# Altium project 手电钻电机驱动板V.PrjPCB
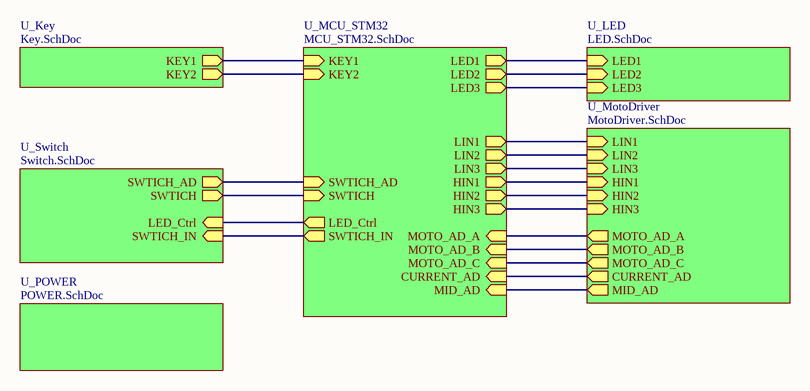
[diagram p0: 手电钻驱动板V.SchDoc]
7 sheets, 105 parts. Net scope: hierarchical (ports join the sheet entries above them; power ports are global).
Board file: 手电钻驱动板V0.1.PcbDoc
Sheets:
  手电钻驱动板V.SchDoc
    U_Key = Key.SchDoc
    U_LED = LED.SchDoc
    U_MCU_STM32 = MCU_STM32.SchDoc
    U_MotoDriver = MotoDriver.SchDoc
    U_Switch = Switch.SchDoc
    U_POWER = POWER.SchDoc

## Sheet 手电钻驱动板V.SchDoc
size A4

### Sub-sheets
U_Key = Key.SchDoc: KEY1 (out), KEY2 (out)
U_LED = LED.SchDoc: LED1 (in), LED2 (in), LED3 (in)
U_MCU_STM32 = MCU_STM32.SchDoc: MOTO_AD_A (in), MOTO_AD_B (in), MOTO_AD_C (in), LIN1 (out), LIN2 (out), LIN3 (out), HIN1 (out), HIN2 (out), HIN3 (out), MID_AD (in), CURRENT_AD (in), LED_Ctrl (out), SWTICH_AD (in), SWTICH_IN (out), SWTICH (in), LED1 (out), LED2 (out), LED3 (out), KEY1 (in), KEY2 (in)
U_MotoDriver = MotoDriver.SchDoc: LIN1 (in), LIN2 (in), LIN3 (in), HIN1 (in), HIN2 (in), HIN3 (in), MID_AD (out), CURRENT_AD (out), MOTO_AD_A (out), MOTO_AD_B (out), MOTO_AD_C (out)
U_POWER = POWER.SchDoc: no entries
U_Switch = Switch.SchDoc: LED_Ctrl (in), SWTICH_AD (out), SWTICH_IN (in), SWTICH (out)

### Nets
CURRENT_AD: sheet U_MCU_STM32/CURRENT_AD, sheet U_MotoDriver/CURRENT_AD
HIN1: sheet U_MCU_STM32/HIN1, sheet U_MotoDriver/HIN1
HIN2: sheet U_MCU_STM32/HIN2, sheet U_MotoDriver/HIN2
HIN3: sheet U_MCU_STM32/HIN3, sheet U_MotoDriver/HIN3
KEY1: sheet U_Key/KEY1, sheet U_MCU_STM32/KEY1
KEY2: sheet U_Key/KEY2, sheet U_MCU_STM32/KEY2
LED1: sheet U_LED/LED1, sheet U_MCU_STM32/LED1
LED2: sheet U_LED/LED2, sheet U_MCU_STM32/LED2
LED3: sheet U_LED/LED3, sheet U_MCU_STM32/LED3
LED_Ctrl: sheet U_MCU_STM32/LED_Ctrl, sheet U_Switch/LED_Ctrl
LIN1: sheet U_MCU_STM32/LIN1, sheet U_MotoDriver/LIN1
LIN2: sheet U_MCU_STM32/LIN2, sheet U_MotoDriver/LIN2
LIN3: sheet U_MCU_STM32/LIN3, sheet U_MotoDriver/LIN3
MID_AD: sheet U_MCU_STM32/MID_AD, sheet U_MotoDriver/MID_AD
MOTO_AD_A: sheet U_MCU_STM32/MOTO_AD_A, sheet U_MotoDriver/MOTO_AD_A
MOTO_AD_B: sheet U_MCU_STM32/MOTO_AD_B, sheet U_MotoDriver/MOTO_AD_B
MOTO_AD_C: sheet U_MCU_STM32/MOTO_AD_C, sheet U_MotoDriver/MOTO_AD_C
SWTICH: sheet U_MCU_STM32/SWTICH, sheet U_Switch/SWTICH
SWTICH_AD: sheet U_MCU_STM32/SWTICH_AD, sheet U_Switch/SWTICH_AD
SWTICH_IN: sheet U_MCU_STM32/SWTICH_IN, sheet U_Switch/SWTICH_IN

## Sheet Key.SchDoc
size A4
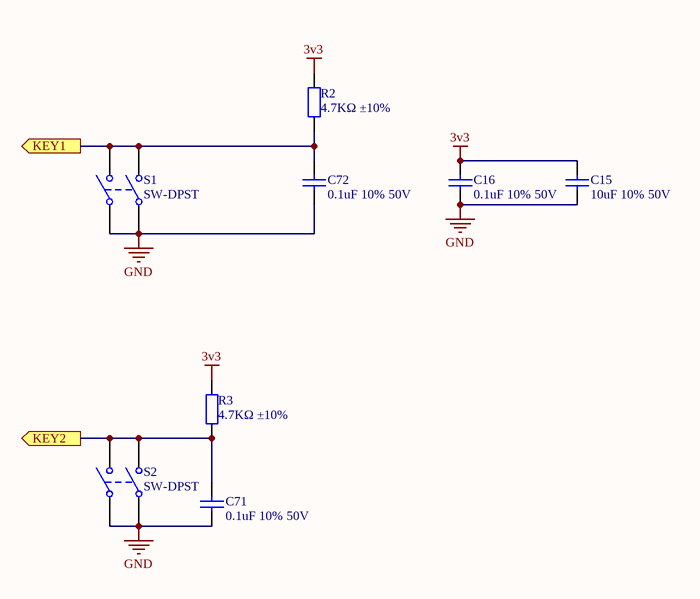
[diagram p1: Key.SchDoc]

### Parts
C15  10uF 10% 50V  [0805_C]
C16  0.1uF 10% 50V  [0603_C]
C71  0.1uF 10% 50V  [0603_C]
C72  0.1uF 10% 50V  [0603_C]
R2  4.7KΩ ±10%  [0603_R]
R3  4.7KΩ ±10%  [0603_R]
S1  SW-DPST  [SW1]
S2  SW-DPST  [SW1]

### Ports
KEY1 (out), KEY2 (out)

### Nets
3v3: C15.2 C16.2 R2.2 R3.2
GND: C15.1 C16.1 C71.1 C72.1 S1.1(COMMON1) S1.3(COMMON2) S2.1(COMMON1) S2.3(COMMON2)
KEY1: C72.2 R2.1 S1.2(NO1) S1.4(NO2) ; port KEY1
KEY2: C71.2 R3.1 S2.2(NO1) S2.4(NO2) ; port KEY2

### Library data of the parts
C15 C16 C71 C72 = 0603 4.7uF (475) 10% 16V: 贴片电容; ComponentLink1Description: 供应商链接; ComponentLink1URL: http://www.szlcsc.com/product/details_20375.html; Package: 0603; Supplier: LC; SuppliersPartNumber: C19666
R2 R3 = 0603 2.2Ω (2R20) 1%: 贴片电阻; ComponentLink1Description: 供应商链接; ComponentLink1URL: http://www.szlcsc.com/product/details_23666.html; Package: 0603; Supplier: LC; SuppliersPartNumber: C22939
S1 S2 = SW-DPST: Double-Pole, Single-Throw Switch; Published: 24-Mar-1999; LatestRevisionDate: 17-Jul-2002; LatestRevisionNote: Re-released for DXP Platform.; PackageReference: DPST-4; Publisher: Altium Limited; PackageDescription: Switch; 4 Leads

## Sheet LED.SchDoc
size A4
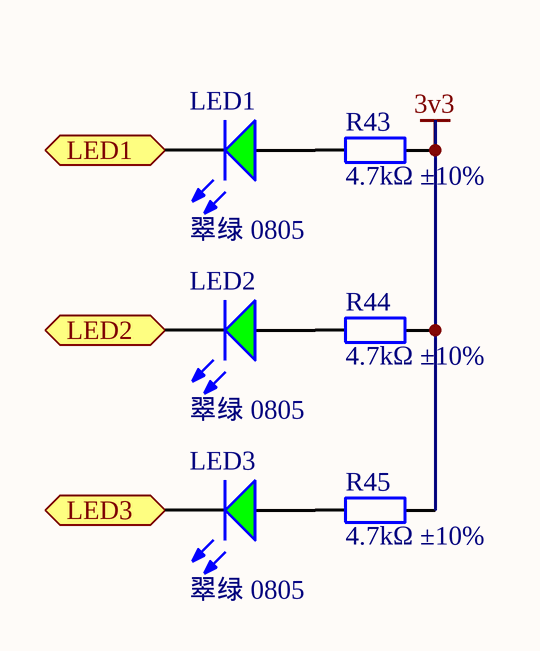
[diagram p2: LED.SchDoc]

### Parts
LED1  翠绿 0805  [0805_LED_S1]
LED2  翠绿 0805  [0805_LED_S1]
LED3  翠绿 0805  [0805_LED_S1]
R43  4.7kΩ ±10%  [0603_R]
R44  4.7kΩ ±10%  [0603_R]
R45  4.7kΩ ±10%  [0603_R]

### Ports
LED1 (in), LED2 (in), LED3 (in)

### Nets
3v3: R43.2 R44.2 R45.2
LED1: LED1.K ; port LED1
LED2: LED2.K ; port LED2
LED3: LED3.K ; port LED3
NetLED1_A: LED1.A R43.1
NetLED2_A: LED2.A R44.1
NetLED3_A: LED3.A R45.1

### Library data of the parts
LED1-LED3 = 0805 翠绿: 发光二极管; ComponentLink1Description: 供应商链接; ComponentLink1URL: http://www.szlcsc.com/product/details_2670.html; Package: 0805; Supplier: LC; SuppliersPartNumber: C2297
R43-R45 = 0603 2.2Ω (2R20) 1%: 贴片电阻; ComponentLink1Description: 供应商链接; ComponentLink1URL: http://www.szlcsc.com/product/details_23666.html; Package: 0603; Supplier: LC; SuppliersPartNumber: C22939

## Sheet MCU_STM32.SchDoc
size A4
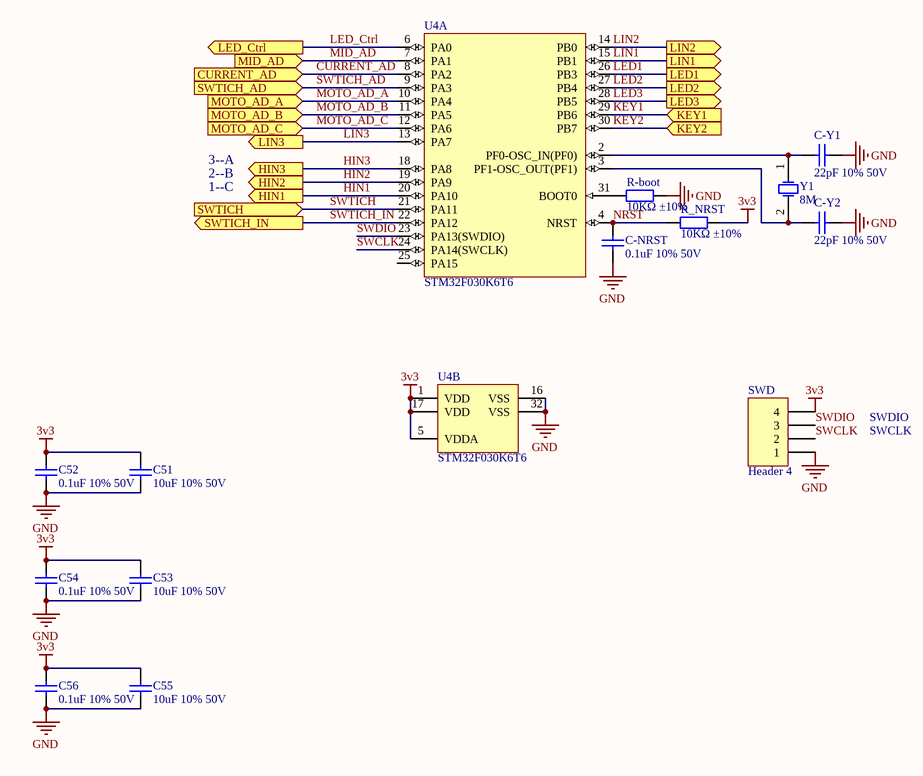
[diagram p3: MCU_STM32.SchDoc]

### Parts
C51  10uF 10% 50V  [0805_C]
C52  0.1uF 10% 50V  [0603_C]
C53  10uF 10% 50V  [0805_C]
C54  0.1uF 10% 50V  [0603_C]
C55  10uF 10% 50V  [0805_C]
C56  0.1uF 10% 50V  [0603_C]
C-NRST  0.1uF 10% 50V  [0603_C]
C-Y1  22pF 10% 50V  [0603_C]
C-Y2  22pF 10% 50V  [0603_C]
R-boot  10KΩ ±10%  [0603_R]
R_NRST  10KΩ ±10%  [0603_R]
SWD  Header 4  [FPC_1.25_4P]
U4  STM32F030K6T6  [STM-LQFP32_M]  (parts A,B of 2)
Y1  8M  [XTAL]

### Ports
CURRENT_AD (in), HIN1 (out), HIN2 (out), HIN3 (out), KEY1 (in), KEY2 (in), LED1 (out), LED2 (out), LED3 (out), LED_Ctrl (out), LIN1 (out), LIN2 (out), LIN3 (out), MID_AD (in), MOTO_AD_A (in), MOTO_AD_B (in), MOTO_AD_C (in), SWTICH (in), SWTICH_AD (in), SWTICH_IN (out)

### Nets
3v3: C51.2 C52.2 C53.2 C54.2 C55.2 C56.2 R_NRST.1 SWD.4 U4.1(VDD) U4.5(VDDA) U4.17(VDD)
GND: C51.1 C52.1 C53.1 C54.1 C55.1 C56.1 C-NRST.1 C-Y1.1 C-Y2.1 R-boot.1 SWD.1 U4.16(VSS) U4.32(VSS)
CURRENT_AD: U4.8(PA2) ; port CURRENT_AD
HIN1: U4.20(PA10) ; port HIN1
HIN2: U4.19(PA9) ; port HIN2
HIN3: U4.18(PA8) ; port HIN3
KEY1: U4.29(PB6) ; port KEY1
KEY2: U4.30(PB7) ; port KEY2
LED1: U4.26(PB3) ; port LED1
LED2: U4.27(PB4) ; port LED2
LED3: U4.28(PB5) ; port LED3
LED_Ctrl: U4.6(PA0) ; port LED_Ctrl
LIN1: U4.15(PB1) ; port LIN1
LIN2: U4.14(PB0) ; port LIN2
LIN3: U4.13(PA7) ; port LIN3
MID_AD: U4.7(PA1) ; port MID_AD
MOTO_AD_A: U4.10(PA4) ; port MOTO_AD_A
MOTO_AD_B: U4.11(PA5) ; port MOTO_AD_B
MOTO_AD_C: U4.12(PA6) ; port MOTO_AD_C
NRST: C-NRST.2 R_NRST.2 U4.4(NRST)
SWCLK: SWD.2 U4.24(PA14(SWCLK))
SWDIO: SWD.3 U4.23(PA13(SWDIO))
SWTICH: U4.21(PA11) ; port SWTICH
SWTICH_AD: U4.9(PA3) ; port SWTICH_AD
SWTICH_IN: U4.22(PA12) ; port SWTICH_IN
NetC-Y1_2: C-Y1.2 U4.2(PF0-OSC_IN(PF0)) Y1.1(OSC1)
NetC-Y2_2: C-Y2.2 U4.3(PF1-OSC_OUT(PF1)) Y1.2(OSC2)
NetR-boot_2: R-boot.2 U4.31(BOOT0)

Not connected (* = marked no-connect by the designer): U4 25(PA15)

### Notes on the sheet
- 3--A
- 2--B
- 1--C
- SWDIO
- SWCLK

### Library data of the parts
C51 C53 C55 = 0805 1uF (105) 10% 50V: 贴片电容; ComponentLink1Description: 供应商链接; ComponentLink1URL: http://www.szlcsc.com/product/details_29074.html; Package: 0805; Supplier: LC; SuppliersPartNumber: C28323
C52 C54 C56 C-NRST C-Y1 C-Y2 = 0603 4.7uF (475) 10% 16V: 贴片电容; ComponentLink1Description: 供应商链接; ComponentLink1URL: http://www.szlcsc.com/product/details_20375.html; Package: 0603; Supplier: LC; SuppliersPartNumber: C19666
R-boot R_NRST = 0603 2.2Ω (2R20) 1%: 贴片电阻; ComponentLink1Description: 供应商链接; ComponentLink1URL: http://www.szlcsc.com/product/details_23666.html; Package: 0603; Supplier: LC; SuppliersPartNumber: C22939
SWD = Header 4: Header, 4-Pin; LatestRevisionDate: 17-Jul-2002; LatestRevisionNote: Re-released for DXP Platform.; Publisher: Altium Limited
U4 = MC-ARM-STM32F030-SQ32
Y1 = XTAL: Crystal Oscillator; Published: 8-Jun-2000; LatestRevisionDate: 17-Jul-2002; LatestRevisionNote: Re-released for DXP Platform.; PackageReference: R38; Publisher: Altium Limited; PackageDescription: Crystal, Thru-Hole; 2 Leads; Body 3.1 x 8.2 mm (Dia.xH)

## Sheet MotoDriver.SchDoc
size A4
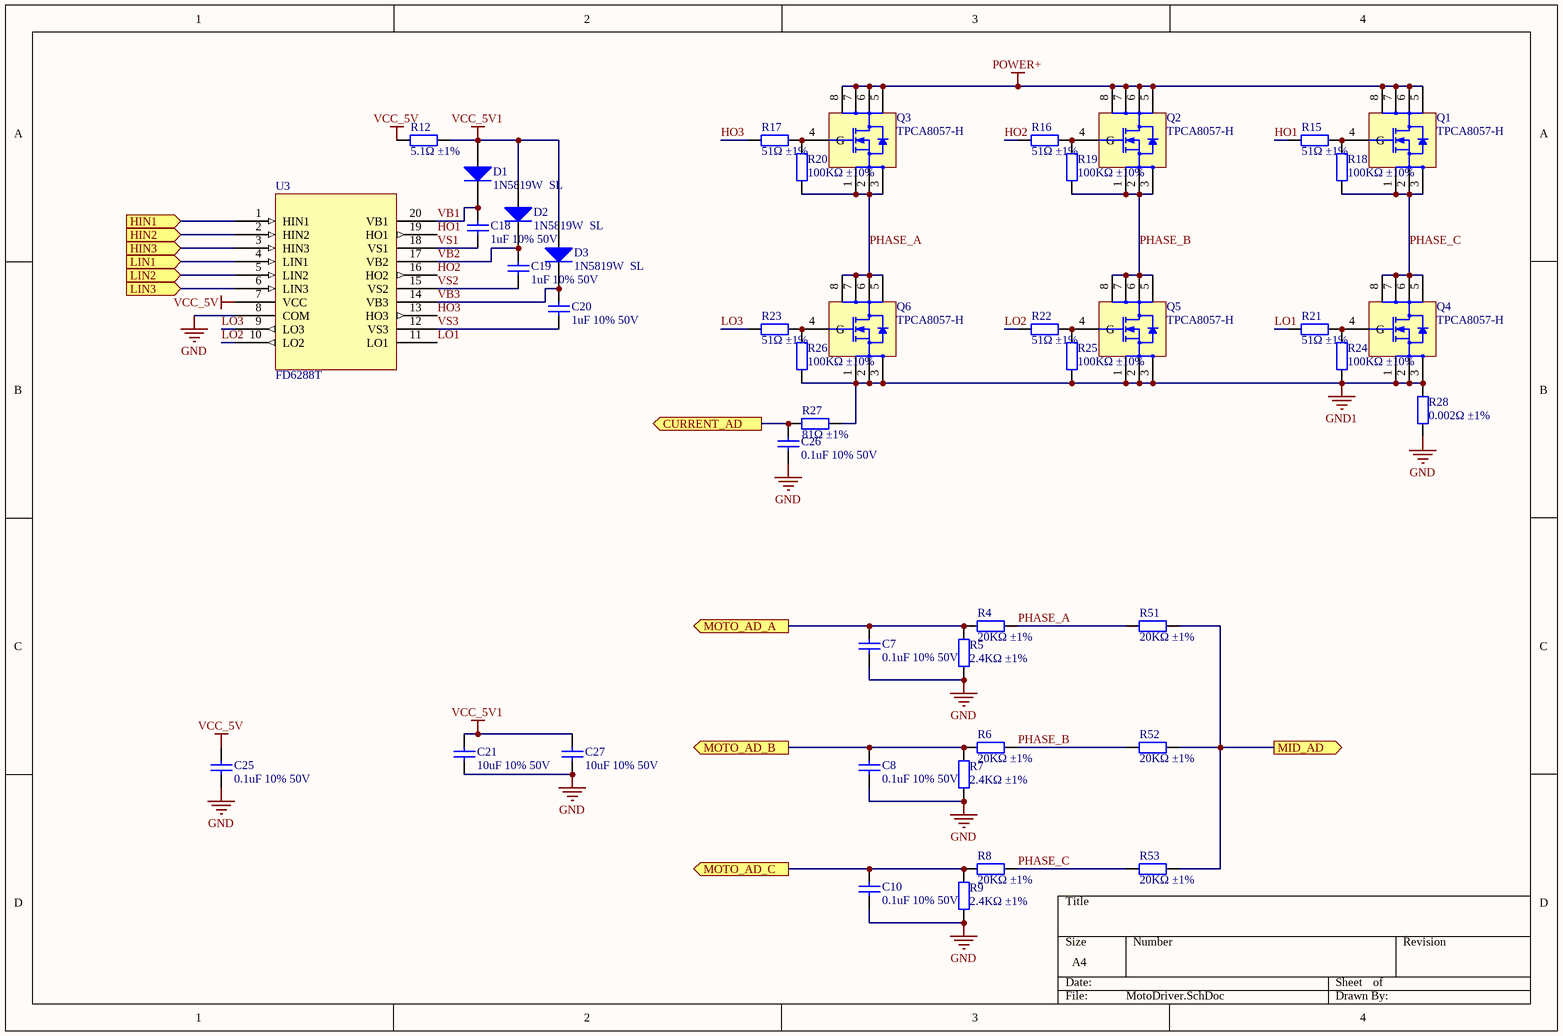
[diagram p4: MotoDriver.SchDoc]

### Parts
C7  0.1uF 10% 50V  [0603_C]
C8  0.1uF 10% 50V  [0603_C]
C10  0.1uF 10% 50V  [0603_C]
C18  1uF 10% 50V  [0805_C]
C19  1uF 10% 50V  [0805_C]
C20  1uF 10% 50V  [0805_C]
C21  10uF 10% 50V  [0805_C]
C25  0.1uF 10% 50V  [0603_C]
C26  0.1uF 10% 50V  [0603_C]
C27  10uF 10% 50V  [0805_C]
D1  1N5819W  SL  [SOD-123]
D2  1N5819W  SL  [SOD-123]
D3  1N5819W  SL  [SOD-123]
Q1  TPCA8057-H  [TPCA8057-H]
Q2  TPCA8057-H  [TPCA8057-H]
Q3  TPCA8057-H  [TPCA8057-H]
Q4  TPCA8057-H  [TPCA8057-H]
Q5  TPCA8057-H  [TPCA8057-H]
Q6  TPCA8057-H  [TPCA8057-H]
R4  20KΩ ±1%  [0603_R]
R5  2.4KΩ ±1%  [0603_R]
R6  20KΩ ±1%  [0603_R]
R7  2.4KΩ ±1%  [0603_R]
R8  20KΩ ±1%  [0603_R]
R9  2.4KΩ ±1%  [0603_R]
R12  5.1Ω ±1%  [1206_R]
R15  51Ω ±1%  [0603_R]
R16  51Ω ±1%  [0603_R]
R17  51Ω ±1%  [0603_R]
R18  100KΩ ±10%  [0603_R]
R19  100KΩ ±10%  [0603_R]
R20  100KΩ ±10%  [0603_R]
R21  51Ω ±1%  [0603_R]
R22  51Ω ±1%  [0603_R]
R23  51Ω ±1%  [0603_R]
R24  100KΩ ±10%  [0603_R]
R25  100KΩ ±10%  [0603_R]
R26  100KΩ ±10%  [0603_R]
R27  81Ω ±1%  [0603_R]
R28  0.002Ω ±1%  [RESC2512(6432)_M]
R51  20KΩ ±1%  [0603_R]
R52  20KΩ ±1%  [0603_R]
R53  20KΩ ±1%  [0603_R]
U3  FD6288T  [TSSOP20_M]

### Ports
CURRENT_AD (out), HIN1 (in), HIN2 (in), HIN3 (in), LIN1 (in), LIN2 (in), LIN3 (in), MID_AD (out), MOTO_AD_A (out), MOTO_AD_B (out), MOTO_AD_C (out)

### Nets
GND: C7.1 C8.1 C10.1 C21.1 C25.1 C26.1 C27.1 R5.1 R7.1 R9.1 R28.1 U3.8(COM)
GND1: Q4.1(S) Q4.2(S) Q4.3(S) Q5.1(S) Q5.2(S) Q5.3(S) Q6.1(S) Q6.2(S) Q6.3(S) R24.1 R25.1 R26.1 R27.2 R28.2
POWER+: Q1.5(D) Q1.6(D) Q1.7(D) Q1.8(D) Q2.5(D) Q2.6(D) Q2.7(D) Q2.8(D) Q3.5(D) Q3.6(D) Q3.7(D) Q3.8(D)
VCC_5V: C25.2 R12.1 U3.7(VCC)
VCC_5V1: C21.2 C27.2 D1.1(A) D2.1(A) D3.1(A) R12.2
CURRENT_AD: C26.2 R27.1 ; port CURRENT_AD
HIN1: U3.1(HIN1) ; port HIN1
HIN2: U3.2(HIN2) ; port HIN2
HIN3: U3.3(HIN3) ; port HIN3
HO1: R15.1 U3.19(HO1)
HO2: R16.1 U3.16(HO2)
HO3: R17.1 U3.13(HO3)
LIN1: U3.4(LIN1) ; port LIN1
LIN2: U3.5(LIN2) ; port LIN2
LIN3: U3.6(LIN3) ; port LIN3
LO1: R21.1 U3.11(LO1)
LO2: R22.1 U3.10(LO2)
LO3: R23.1 U3.9(LO3)
MID_AD: R51.2 R52.2 R53.2 ; port MID_AD
MOTO_AD_A: C7.2 R4.1 R5.2 ; port MOTO_AD_A
MOTO_AD_B: C8.2 R6.1 R7.2 ; port MOTO_AD_B
MOTO_AD_C: C10.2 R8.1 R9.2 ; port MOTO_AD_C
PHASE_A: Q3.1(S) Q3.2(S) Q3.3(S) Q6.5(D) Q6.6(D) Q6.7(D) Q6.8(D) R4.2 R20.1 R51.1
PHASE_B: Q2.1(S) Q2.2(S) Q2.3(S) Q5.5(D) Q5.6(D) Q5.7(D) Q5.8(D) R6.2 R19.1 R52.1
PHASE_C: Q1.1(S) Q1.2(S) Q1.3(S) Q4.5(D) Q4.6(D) Q4.7(D) Q4.8(D) R8.2 R18.1 R53.1
VB1: C18.2 D1.2(K) U3.20(VB1)
VB2: C19.2 D2.2(K) U3.17(VB2)
VB3: C20.2 D3.2(K) U3.14(VB3)
VS1: C18.1 U3.18(VS1)
VS2: C19.1 U3.15(VS2)
VS3: C20.1 U3.12(VS3)
NetQ1_4: Q1.4(G) R15.2 R18.2
NetQ2_4: Q2.4(G) R16.2 R19.2
NetQ3_4: Q3.4(G) R17.2 R20.2
NetQ4_4: Q4.4(G) R21.2 R24.2
NetQ5_4: Q5.4(G) R22.2 R25.2
NetQ6_4: Q6.4(G) R23.2 R26.2

### Library data of the parts
C7 C8 C10 C25-C27 = 0603 4.7uF (475) 10% 16V: 贴片电容; ComponentLink1Description: 供应商链接; ComponentLink1URL: http://www.szlcsc.com/product/details_20375.html; Package: 0603; Supplier: LC; SuppliersPartNumber: C19666
C18-C21 = 0805 1uF (105) 10% 50V: 贴片电容; ComponentLink1Description: 供应商链接; ComponentLink1URL: http://www.szlcsc.com/product/details_29074.html; Package: 0805; Supplier: LC; SuppliersPartNumber: C28323
D1-D3 = SOD-123 B5819W  SL: 肖特基二极管; ComponentLink1Description: 供应商链接; ComponentLink1URL: http://www.szlcsc.com/product/details_9093.html; Package: SOD-123; Supplier: LC; SuppliersPartNumber: C8598
Q1-Q6 = TPCA8057-H: MOSFETsSilicon N-Channel MOS (U-MOS-H)
R4-R9 R15-R28 R51-R53 = 0603 2.2Ω (2R20) 1%: 贴片电阻; ComponentLink1Description: 供应商链接; ComponentLink1URL: http://www.szlcsc.com/product/details_23666.html; Package: 0603; Supplier: LC; SuppliersPartNumber: C22939
R12 = 0402 51Ω (51R0) 1%: 贴片电阻; ComponentLink1Description: 供应商链接; ComponentLink1URL: http://www.szlcsc.com/product/details_25868.html; Package: 0402; Supplier: LC; SuppliersPartNumber: C25125
U3 = FD6288T: USB to TTL Serial / UART

## Sheet Switch.SchDoc
size A4
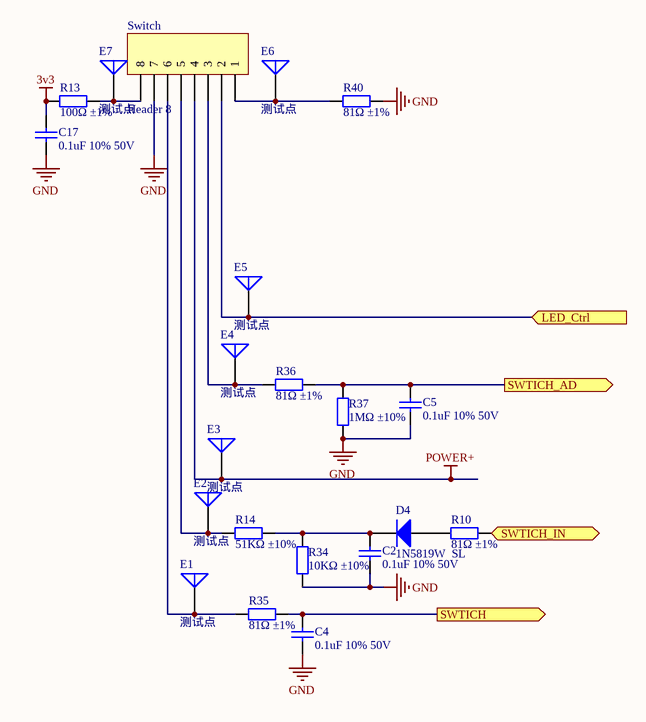
[diagram p5: Switch.SchDoc]

### Parts
C2  0.1uF 10% 50V  [0603_C]
C4  0.1uF 10% 50V  [0603_C]
C5  0.1uF 10% 50V  [0603_C]
C17  0.1uF 10% 50V  [0603_C]
D4  1N5819W  SL  [SOD-123]
E1  测试点  [Test]
E2  测试点  [Test]
E3  测试点  [Test]
E4  测试点  [Test]
E5  测试点  [Test]
E6  测试点  [Test]
E7  测试点  [Test]
R10  81Ω ±1%  [0603_R]
R13  100Ω ±1%  [0603_R]
R14  51KΩ ±10%  [0603_R]
R34  10KΩ ±10%  [0603_R]
R35  81Ω ±1%  [0603_R]
R36  81Ω ±1%  [0603_R]
R37  1MΩ ±10%  [0603_R]
R40  81Ω ±1%  [0603_R]
Switch  Header 8  [SH1.0mm-8P]

### Ports
LED_Ctrl (in), SWTICH (out), SWTICH_AD (out), SWTICH_IN (in)

### Nets
3v3: C17.2 R13.1
GND: C2.1 C4.1 C5.1 C17.1 R34.1 R37.1 R40.2 Switch.7
POWER+: E3.1(A) Switch.4
LED_Ctrl: E5.1(A) Switch.2 ; port LED_Ctrl
SWTICH: C4.2 R35.2 ; port SWTICH
SWTICH_AD: C5.2 R36.2 R37.2 ; port SWTICH_AD
SWTICH_IN: R10.2 ; port SWTICH_IN
NetC2_2: C2.2 D4.2(K) R14.2 R34.2
NetD4_1: D4.1(A) R10.1
NetE1_1: E1.1(A) R35.1 Switch.6
NetE2_1: E2.1(A) R14.1 Switch.5
NetE4_1: E4.1(A) R36.1 Switch.3
NetE6_1: E6.1(A) R40.1 Switch.1
NetE7_1: E7.1(A) R13.2 Switch.8

### Library data of the parts
C2 C4 C5 C17 = 0603 4.7uF (475) 10% 16V: 贴片电容; ComponentLink1Description: 供应商链接; ComponentLink1URL: http://www.szlcsc.com/product/details_20375.html; Package: 0603; Supplier: LC; SuppliersPartNumber: C19666
D4 = SOD-123 B5819W  SL: 肖特基二极管; ComponentLink1Description: 供应商链接; ComponentLink1URL: http://www.szlcsc.com/product/details_9093.html; Package: SOD-123; Supplier: LC; SuppliersPartNumber: C8598
E1-E7 = Antenna: Generic Antenna; Published: 24-Mar-1999; LatestRevisionDate: 17-Jul-2002; LatestRevisionNote: Re-released for DXP Platform.; PackageReference: PIN1; Publisher: Altium Limited
R10 R13 R14 R34-R37 R40 = 0603 2.2Ω (2R20) 1%: 贴片电阻; ComponentLink1Description: 供应商链接; ComponentLink1URL: http://www.szlcsc.com/product/details_23666.html; Package: 0603; Supplier: LC; SuppliersPartNumber: C22939
Switch = Header 8: Header, 8-Pin; LatestRevisionDate: 17-Jul-2002; LatestRevisionNote: Re-released for DXP Platform.; Publisher: Altium Limited

## Sheet POWER.SchDoc
size A4
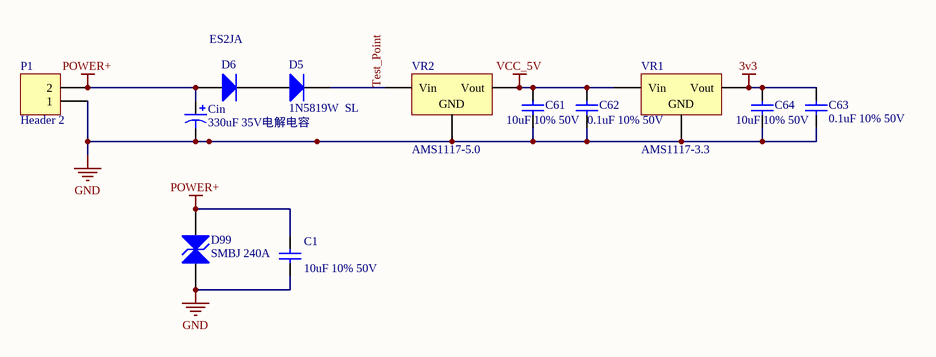
[diagram p6: POWER.SchDoc]

### Parts
C1  10uF 10% 50V  [0805_C]
C61  10uF 10% 50V  [0805_C]
C62  0.1uF 10% 50V  [0603_C]
C63  0.1uF 10% 50V  [0603_C]
C64  10uF 10% 50V  [0805_C]
Cin  330uF 35V电解电容  [330uf/35V]
D5  1N5819W  SL  [SOD-123]
D6  ES2JA  [SMA(DO-214AC)_S1]
D99  SMBJ 240A  [SMB(DO-214AA)_S1]
P1  Header 2  [2星座子]
VR1  AMS1117-3.3  [SOT-223]
VR2  AMS1117-5.0  [SOT-223]

### Nets
3v3: C63.2 C64.1 VR1.2(Vout)
GND: C1.2 C61.2 C62.1 C63.1 C64.2 Cin.2 D99.1(A) P1.1 VR1.1(GND) VR2.1(GND)
POWER+: C1.1 Cin.1 D6.1(A) D99.2(K) P1.2
VCC_5V: C61.1 C62.2 VR1.3(Vin) VR2.2(Vout)
Test_Point: D5.2(K) VR2.3(Vin)
NetD5_1: D5.1(A) D6.2(K)

### Library data of the parts
C1 C61-C64 = Cap Semi: Capacitor (Semiconductor SIM Model); Published: 8-Jun-2000; PackageReference: C1206; Publisher: Altium Limited
  C1 C61 C64: LatestRevisionDate: 29-May-2009; LatestRevisionNote: IPC-7351 Footprint Added.; Value: 10uF 10% 50V; PackageDescription: Chip Capacitor
  C62 C63: LatestRevisionDate: 17-Jul-2002; LatestRevisionNote: Re-released for DXP Platform.; Value: 0.1uF 10% 50V
Cin = Cap Pol1: Polarized Capacitor (Radial); Published: 8-Jun-2000; LatestRevisionDate: 17-Jul-2002; LatestRevisionNote: Re-released for DXP Platform.; PackageReference: RB7.6-15; Publisher: Altium Limited; PackageDescription: Polarized Capacitor (Radial); 2 Leads; Value: 330uF 35V
D5 = SOD-123 B5819W  SL: 肖特基二极管; ComponentLink1Description: 供应商链接; ComponentLink1URL: http://www.szlcsc.com/product/details_9093.html; Package: SOD-123; Supplier: LC; SuppliersPartNumber: C8598
D6 = SMA(DO-214AC) M7: 二极管; 备注: 1N4007 4007 编号C2464 已经停售, 使用新物料编号C95872; ComponentLink1Description: 供应商链接; ComponentLink1URL: http://www.szlcsc.com/product/details_2841.html; Package: SMA(DO-214AC); Supplier: LC; SuppliersPartNumber: C95872
D99 = SMB/DO-214AA P6SMB6.8CA: TVS; ComponentLink1Description: 供应商链接; ComponentLink1URL: http://www.szlcsc.com/product/details_79530.html; Package: SMB/DO-214AA; Supplier: LC; SuppliersPartNumber: C78395
P1 = Header 2: Header, 2-Pin; LatestRevisionDate: 17-Jul-2002; LatestRevisionNote: Re-released for DXP Platform.; Publisher: Altium Limited
VR1 VR2 = SOT-223 AMS1117-5.0: 低压差线性稳压(LDO); ComponentLink1Description: 供应商链接; ComponentLink1URL: http://www.szlcsc.com/product/details_6653.html; Package: SOT-223; Supplier: LC; SuppliersPartNumber: C6187

## Nets that join several sheets
3v3: Key (C15.2 C16.2 R2.2 R3.2), LED (R43.2 R44.2 R45.2), MCU_STM32 (11 pins), Switch (C17.2 R13.1), POWER (C63.2 C64.1 VR1.2)
GND: Key (8 pins), MCU_STM32 (13 pins), MotoDriver (12 pins), Switch (8 pins), POWER (10 pins)
POWER+: MotoDriver (12 pins), Switch (E3.1 Switch.4), POWER (5 pins)
VCC_5V: MotoDriver (C25.2 R12.1 U3.7), POWER (C61.1 C62.2 VR1.3 VR2.2)
CURRENT_AD: MCU_STM32 (U4.8), MotoDriver (C26.2 R27.1)
HIN1: MCU_STM32 (U4.20), MotoDriver (U3.1)
HIN2: MCU_STM32 (U4.19), MotoDriver (U3.2)
HIN3: MCU_STM32 (U4.18), MotoDriver (U3.3)
KEY1: Key (C72.2 R2.1 S1.2 S1.4), MCU_STM32 (U4.29)
KEY2: Key (C71.2 R3.1 S2.2 S2.4), MCU_STM32 (U4.30)
LED1: LED (LED1.K), MCU_STM32 (U4.26)
LED2: LED (LED2.K), MCU_STM32 (U4.27)
LED3: LED (LED3.K), MCU_STM32 (U4.28)
LED_Ctrl: MCU_STM32 (U4.6), Switch (E5.1 Switch.2)
LIN1: MCU_STM32 (U4.15), MotoDriver (U3.4)
LIN2: MCU_STM32 (U4.14), MotoDriver (U3.5)
LIN3: MCU_STM32 (U4.13), MotoDriver (U3.6)
MID_AD: MCU_STM32 (U4.7), MotoDriver (R51.2 R52.2 R53.2)
MOTO_AD_A: MCU_STM32 (U4.10), MotoDriver (C7.2 R4.1 R5.2)
MOTO_AD_B: MCU_STM32 (U4.11), MotoDriver (C8.2 R6.1 R7.2)
MOTO_AD_C: MCU_STM32 (U4.12), MotoDriver (C10.2 R8.1 R9.2)
SWTICH: MCU_STM32 (U4.21), Switch (C4.2 R35.2)
SWTICH_AD: MCU_STM32 (U4.9), Switch (C5.2 R36.2 R37.2)
SWTICH_IN: MCU_STM32 (U4.22), Switch (R10.2)